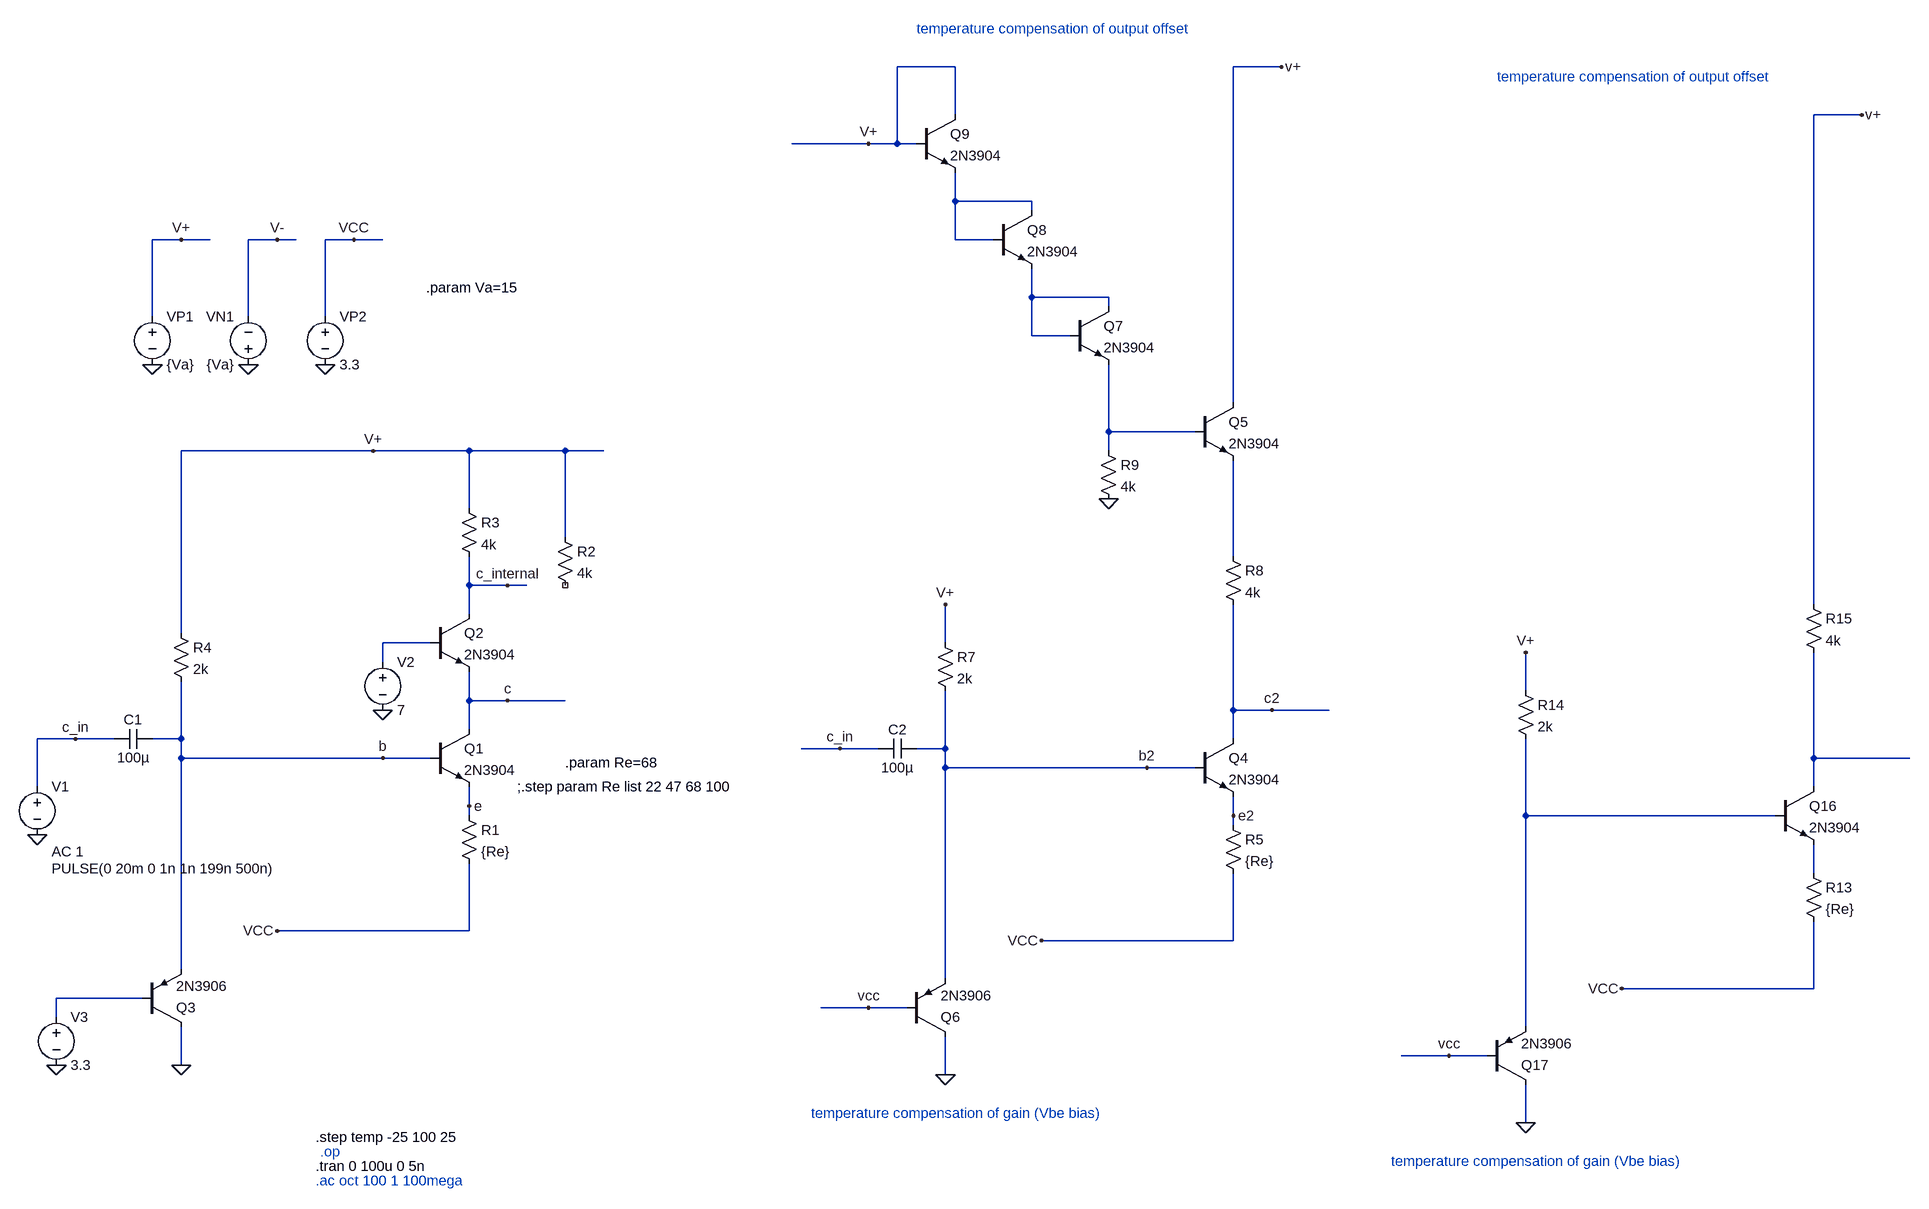
[diagram p0: schematic cascode_playground.asc]
cascode_playground.asc, the LTspice schematic file:
Version 4.1
SHEET 1 4324 1064
WIRE 1072 -1008 976 -1008
WIRE 1616 -1008 1536 -1008
WIRE 1072 -928 1072 -1008
WIRE 4240 -928 4160 -928
WIRE 928 -880 800 -880
WIRE 976 -880 976 -1008
WIRE 976 -880 928 -880
WIRE 1008 -880 976 -880
WIRE 1072 -784 1072 -832
WIRE 1200 -784 1072 -784
WIRE 1200 -768 1200 -784
WIRE -256 -720 -304 -720
WIRE -208 -720 -256 -720
WIRE -96 -720 -144 -720
WIRE -64 -720 -96 -720
WIRE 32 -720 -16 -720
WIRE 80 -720 32 -720
WIRE 1072 -720 1072 -784
WIRE 1136 -720 1072 -720
WIRE 1200 -624 1200 -672
WIRE 1328 -624 1200 -624
WIRE 1328 -608 1328 -624
WIRE -304 -592 -304 -720
WIRE -144 -592 -144 -720
WIRE -16 -592 -16 -720
WIRE 1200 -560 1200 -624
WIRE 1264 -560 1200 -560
WIRE 1536 -448 1536 -1008
WIRE 1328 -400 1328 -512
WIRE 1472 -400 1328 -400
WIRE 64 -368 -256 -368
WIRE 224 -368 64 -368
WIRE 384 -368 224 -368
WIRE 448 -368 384 -368
WIRE 1328 -368 1328 -400
WIRE 224 -272 224 -368
WIRE 384 -224 384 -368
WIRE 1536 -192 1536 -352
WIRE 224 -144 224 -192
WIRE 288 -144 224 -144
WIRE 320 -144 288 -144
WIRE 4160 -112 4160 -928
WIRE 224 -96 224 -144
WIRE -256 -64 -256 -368
WIRE 160 -48 80 -48
WIRE 1056 -48 1056 -112
WIRE 80 -16 80 -48
WIRE 3680 32 3680 -32
WIRE 224 48 224 0
WIRE 288 48 224 48
WIRE 384 48 288 48
WIRE 1536 64 1536 -112
WIRE 1600 64 1536 64
WIRE 1696 64 1600 64
WIRE 224 96 224 48
WIRE -432 112 -496 112
WIRE -368 112 -432 112
WIRE -256 112 -256 16
WIRE -256 112 -304 112
WIRE 1536 112 1536 64
WIRE 880 128 816 128
WIRE 944 128 880 128
WIRE 1056 128 1056 32
WIRE 1056 128 1008 128
WIRE -256 144 -256 112
WIRE 80 144 -256 144
WIRE 160 144 80 144
WIRE 4160 144 4160 -32
WIRE 4320 144 4160 144
WIRE 1056 160 1056 128
WIRE 1392 160 1056 160
WIRE 1472 160 1392 160
WIRE -496 192 -496 112
WIRE 4160 192 4160 144
WIRE 224 224 224 192
WIRE 224 240 224 224
WIRE 1536 240 1536 208
WIRE 3680 240 3680 112
WIRE 4096 240 3680 240
WIRE 1536 256 1536 240
WIRE 4160 336 4160 288
WIRE 224 432 224 320
WIRE 224 432 -96 432
WIRE 1536 448 1536 336
WIRE 1536 448 1216 448
WIRE -256 496 -256 144
WIRE 1056 512 1056 160
WIRE 4160 528 4160 416
WIRE 4160 528 3840 528
WIRE -320 544 -464 544
WIRE 928 560 848 560
WIRE 992 560 928 560
WIRE -464 576 -464 544
WIRE 3680 592 3680 240
WIRE 3552 640 3472 640
WIRE 3616 640 3552 640
WIRE -256 656 -256 592
WIRE 1056 672 1056 608
WIRE 3680 752 3680 688
FLAG 64 -368 V+
FLAG -432 112 c_in
FLAG -496 272 0
FLAG 80 64 0
FLAG 288 -144 c_internal
FLAG -464 656 0
FLAG -304 -512 0
FLAG -144 -512 0
FLAG -256 -720 V+
FLAG -96 -720 V-
FLAG -16 -512 0
FLAG 32 -720 VCC
FLAG -96 432 VCC
FLAG -256 656 0
FLAG 224 224 e
FLAG 80 144 b
FLAG 288 48 c
FLAG 880 128 c_in
FLAG 1216 448 VCC
FLAG 1056 672 0
FLAG 1536 240 e2
FLAG 1392 160 b2
FLAG 1600 64 c2
FLAG 1328 -288 0
FLAG 1056 -112 V+
FLAG 928 -880 V+
FLAG 928 560 vcc
FLAG 1616 -1008 v+
FLAG 3840 528 VCC
FLAG 3680 752 0
FLAG 3680 -32 V+
FLAG 3552 640 vcc
FLAG 4240 -928 v+
SYMBOL npn 160 96 R0
SYMATTR InstName Q1
SYMATTR Value 2N3904
SYMBOL npn 160 -96 R0
SYMATTR InstName Q2
SYMATTR Value 2N3904
SYMBOL res 208 224 R0
SYMATTR InstName R1
SYMATTR Value {Re}
SYMBOL voltage -496 176 R0
WINDOW 123 24 124 Left 2
WINDOW 39 0 0 Left 0
WINDOW 3 24 152 Left 2
SYMATTR Value2 AC 1
SYMATTR Value PULSE(0 20m 0 1n 1n 199n 500n)
SYMATTR InstName V1
SYMBOL cap -304 96 R90
WINDOW 0 0 32 VBottom 2
WINDOW 3 32 32 VTop 2
SYMATTR InstName C1
SYMATTR Value 100µ
SYMBOL voltage 80 -32 R0
SYMATTR InstName V2
SYMATTR Value 7
SYMBOL res 208 -288 R0
SYMATTR InstName R3
SYMATTR Value 4k
SYMBOL voltage -464 560 R0
SYMATTR InstName V3
SYMATTR Value 3.3
SYMBOL res -272 -80 R0
SYMATTR InstName R4
SYMATTR Value 2k
SYMBOL voltage -304 -608 R0
SYMATTR InstName VP1
SYMATTR Value {Va}
SYMBOL voltage -144 -496 R180
WINDOW 0 24 96 Left 2
WINDOW 3 24 16 Left 2
SYMATTR InstName VN1
SYMATTR Value {Va}
SYMBOL voltage -16 -608 R0
SYMATTR InstName VP2
SYMATTR Value 3.3
SYMBOL pnp -320 592 M180
SYMATTR InstName Q3
SYMATTR Value 2N3906
SYMBOL res 368 -240 R0
SYMATTR InstName R2
SYMATTR Value 4k
SYMBOL npn 1472 112 R0
SYMATTR InstName Q4
SYMATTR Value 2N3904
SYMBOL res 1520 240 R0
SYMATTR InstName R5
SYMATTR Value {Re}
SYMBOL cap 1008 112 R90
WINDOW 0 0 32 VBottom 2
WINDOW 3 32 32 VTop 2
SYMATTR InstName C2
SYMATTR Value 100µ
SYMBOL res 1040 -64 R0
SYMATTR InstName R7
SYMATTR Value 2k
SYMBOL pnp 992 608 M180
SYMATTR InstName Q6
SYMATTR Value 2N3906
SYMBOL res 1520 -208 R0
SYMATTR InstName R8
SYMATTR Value 4k
SYMBOL npn 1472 -448 R0
SYMATTR InstName Q5
SYMATTR Value 2N3904
SYMBOL npn 1264 -608 R0
SYMATTR InstName Q7
SYMATTR Value 2N3904
SYMBOL res 1312 -384 R0
SYMATTR InstName R9
SYMATTR Value 4k
SYMBOL npn 1136 -768 R0
SYMATTR InstName Q8
SYMATTR Value 2N3904
SYMBOL npn 1008 -928 R0
SYMATTR InstName Q9
SYMATTR Value 2N3904
SYMBOL npn 4096 192 R0
SYMATTR InstName Q16
SYMATTR Value 2N3904
SYMBOL res 4144 320 R0
SYMATTR InstName R13
SYMATTR Value {Re}
SYMBOL res 3664 16 R0
SYMATTR InstName R14
SYMATTR Value 2k
SYMBOL pnp 3616 688 M180
SYMATTR InstName Q17
SYMATTR Value 2N3906
SYMBOL res 4144 -128 R0
SYMATTR InstName R15
SYMATTR Value 4k
TEXT -32 776 Left 2 !.step temp -25 100 25
TEXT -32 848 Left 2 ;.ac oct 100 1 100mega
TEXT -32 824 Left 2 !.tran 0 100u 0 5n
TEXT -24 800 Left 2 ;.op
TEXT 152 -640 Left 2 !.param Va=15
TEXT 304 192 Left 2 !;.step param Re list 22 47 68 100
TEXT 384 152 Left 2 !.param Re=68
TEXT 1008 -1072 Left 2 ;temperature compensation of output offset
TEXT 832 736 Left 2 ;temperature compensation of gain (Vbe bias)
TEXT 3632 -992 Left 2 ;temperature compensation of output offset
TEXT 3456 816 Left 2 ;temperature compensation of gain (Vbe bias)

The netlist it stands for:
* cascode_playground.asc
Q1 c b e 0 2N3904
Q2 c_internal N005 c 0 2N3904
R1 e VCC {Re}
V1 c_in 0 PULSE(0 20m 0 1n 1n 199n 500n) AC 1
C1 b c_in 100µ
V2 N005 0 7
R3 V+ c_internal 4k
V3 N009 0 3.3
R4 V+ b 2k
VP1 V+ 0 {Va}
VN1 0 V- {Va}
VP2 VCC 0 3.3
Q3 0 N009 b 0 2N3906
R2 V+ NC_01 4k
Q4 c2 b2 e2 0 2N3904
R5 e2 VCC {Re}
C2 b2 c_in 100µ
R7 V+ b2 2k
Q6 0 VCC b2 0 2N3906
R8 N004 c2 4k
Q5 V+ N003 N004 0 2N3904
Q7 N002 N002 N003 0 2N3904
R9 N003 0 4k
Q8 N001 N001 N002 0 2N3904
Q9 V+ V+ N001 0 2N3904
Q16 N006 N007 N008 0 2N3904
R13 N008 VCC {Re}
R14 V+ N007 2k
Q17 0 VCC N007 0 2N3906
R15 V+ N006 4k
.model NPN NPN
.model PNP PNP
.lib standard.bjt
.step temp -25 100 25
* .ac oct 100 1 100mega
.tran 0 100u 0 5n
* .op
.param Va=15
;.step param Re list 22 47 68 100
.param Re=68
* temperature compensation of output offset
* temperature compensation of gain (Vbe bias)
* temperature compensation of output offset
* temperature compensation of gain (Vbe bias)
.backanno
.end